# EAGLE schematic drv8825 (EAGLE 9.1.3)
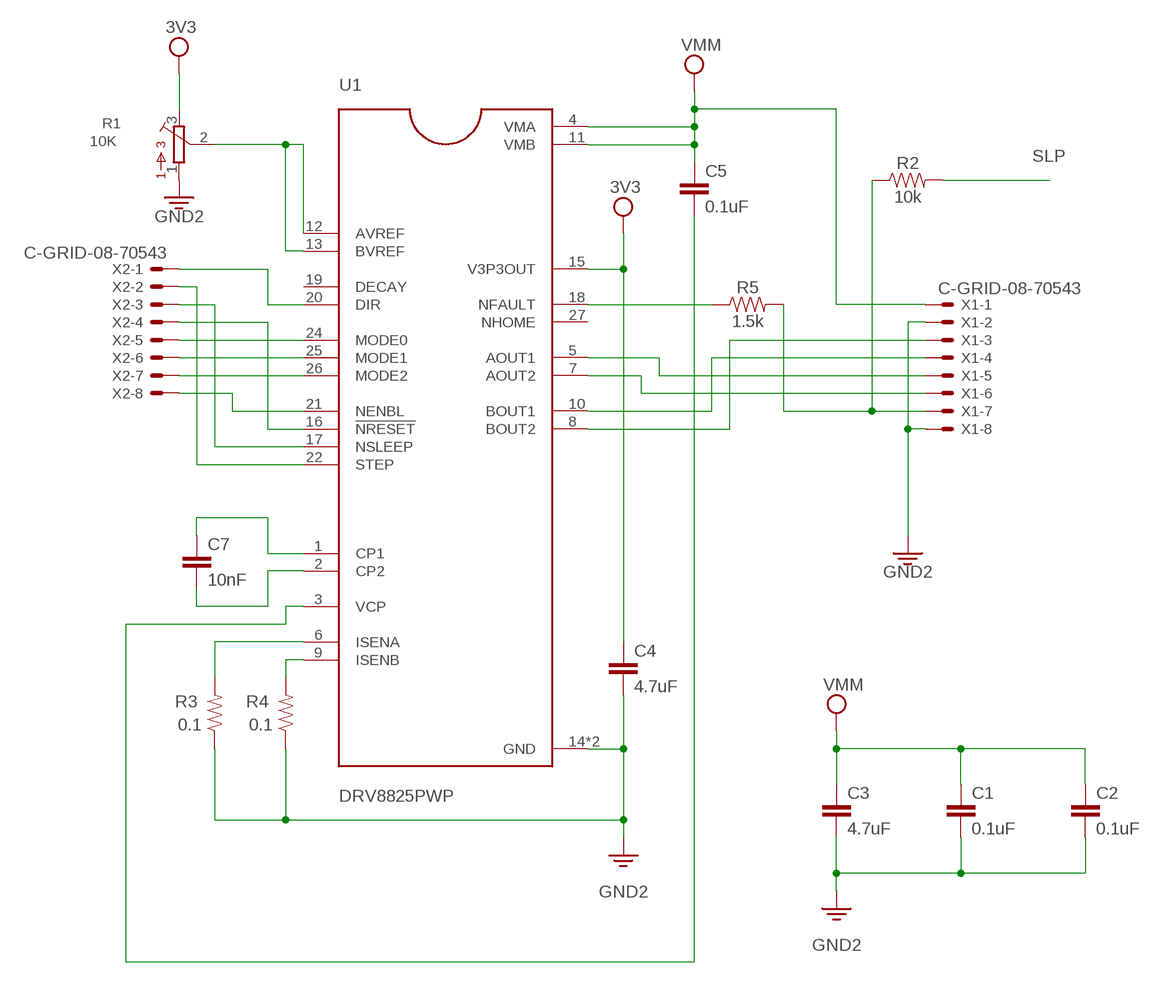
[diagram p0: schematic, sheet 1]

## Parts
C1  0.1uF  0.1UF-0402-16V-10%  [0402]
C2  0.1uF  0.1UF-0402-16V-10%  [0402]
C3  4.7uF  4.7UF0603  [0603]
C4  4.7uF  4.7UF0603  [0603]
C5  0.1uF  0.1UF-0402-16V-10%  [0402]
C7  10nF  10NF-0603-50V-10%  [0603]
R1  10K  3362R  [3362R]
R2  10k  10KOHM-0603-1/10W-1%  [0603]
R3  0.1  0.1OHM-1210-1/2W-1%  [1210]
R4  0.1  0.1OHM-1210-1/2W-1%  [1210]
R5  1.5k  1.5KOHM-0603-1/10W-1%  [0603]
U1  DRV8825PWP  [SOP65P640X120-28N]
X1  C-GRID-08-70543  [70543-08]
X2  C-GRID-08-70543  [70543-08]

## Nets
3.3V: C1.2 C2.2 C3.2 C4.2 R1.1 R3.1 R4.1 U1.14(GND) U1.28(GND) X1.2 X1.8 ; supply symbol labelled GND2
N$1: C7.1 U1.1(CP1)
N$2: C7.2 U1.2(CP2)
N$3: U1.20(DIR) X2.1
N$4: U1.22(STEP) X2.2
N$5: U1.17(NSLEEP) X2.3
N$6: U1.16(!NRESET) X2.4
N$7: U1.24(MODE0) X2.5
N$8: U1.25(MODE1) X2.6
N$9: U1.26(MODE2) X2.7
N$10: U1.21(NENBL) X2.8
N$11: R1.2 U1.12(AVREF) U1.13(BVREF)
N$12: R3.2 U1.6(ISENA)
N$13: R4.2 U1.9(ISENB)
N$14: C5.2 U1.3(VCP)
N$15: R5.1 U1.18(NFAULT)
N$16: R2.1 R5.2 X1.7
N$17: U1.5(AOUT1) X1.5
N$18: U1.7(AOUT2) X1.6
N$19: U1.8(BOUT2) X1.3
N$20: U1.10(BOUT1) X1.4
SLP: R2.2
VCC: C1.1 C2.1 C3.1 C4.1 C5.1 R1.3 U1.4(VMA) U1.11(VMB) U1.15(V3P3OUT) X1.1 ; supply symbol labelled 3V3, VMM
Unconnected: U1.19(DECAY) U1.27(NHOME)

## Library data of the parts
C1 C2 C5 = SparkFun-Capacitors:0.1UF: 0.1µF ceramic capacitors A capacitor is a passive two-terminal electrical component used to store electrical energy temporarily in an electric field.; PROD_ID: CAP-12416
C3 C4 = SparkFun-Capacitors:4.7UF: 4.7µF ceramic capacitors A capacitor is a passive two-terminal electrical component used to store electrical energy temporarily in an electric field.; PROD_ID: CAP-08280
C7 = SparkFun-Capacitors:10NF: 0.01uF/10nF/10,000pF ceramic capacitors A capacitor is a passive two-terminal electrical component used to store electrical energy temporarily in an electric field. CAP-09321; PROD_ID: CAP-00867
R1 = bourns:3362: 3362 Series 1/4" Square Trimmer
R2 = SparkFun-Resistors:10KOHM: 10kΩ resistor A resistor is a passive two-terminal electrical component that implements electrical resistance as a circuit element. Resistors act to reduce current flow, and, at the same time, act to lower voltage levels within circuits. - Wikipedia; PROD_ID: RES-00824
R3 R4 = SparkFun-Resistors:0.1OHM: 0.1Ω resistor A resistor is a passive two-terminal electrical component that implements electrical resistance as a circuit element. Resistors act to reduce current flow, and, at the same time, act to lower voltage levels within circuits. - Wikipedia; PROD_ID: RES-12374
R5 = SparkFun-Resistors:1.5KOHM: 1.5kΩ resistor A resistor is a passive two-terminal electrical component that implements electrical resistance as a circuit element. Resistors act to reduce current flow, and, at the same time, act to lower voltage levels within circuits. - Wikipedia; PROD_ID: RES-08306
U1 = DRV8825PWP:DRV8825PWP: DRV8825 Stepper Motor Controller IC; DESCRIPTION: 2.5A Bipolar Stepper Motor Driver with On-Chip 1/32 Microstepping Indexer _Step/Dir Ctrl_ 28-HTSSOP -40 to 85; DIGI-KEY_PART_NUMBER: 296-28915-5-ND; DIGI-KEY_PURCHASE_URL: https://www.digikey.com/product-detail/en/texas-instruments/DRV8825PWP/296-28915-5-ND/2676775?utm_source=snapeda&utm_medium=aggregator&utm_campaign=symbol; MF: Texas Instruments; MP: DRV8825PWP; PACKAGE: HTSSOP-28 Texas Instruments
X1 X2 = con-molex:C-GRID-08: CONNECTOR wire to board 2.54 mm (0.100") pitch header; MF: MOLEX; OC_FARNELL: unknown; OC_NEWARK: unknown